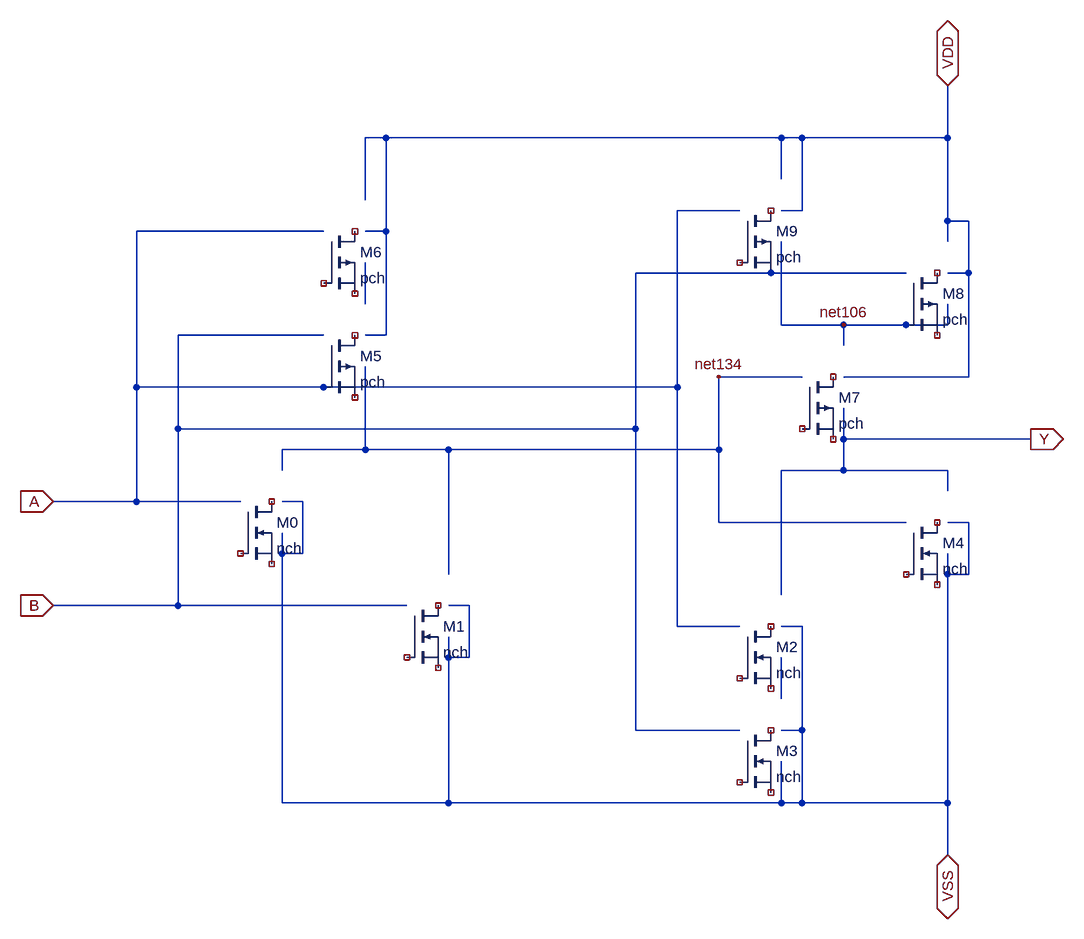
[diagram p0: schematic exor.asc]
exor.asc, the LTspice schematic file:
Version 4
SHEET 1 1680 1376
WIRE 1472 848 1504 848
WIRE 1472 848 1472 816
WIRE 1504 848 1504 768
WIRE 1472 768 1504 768
WIRE 1248 1088 1248 928
WIRE 1216 928 1248 928
WIRE 1248 1200 1472 1200
WIRE 1248 1200 1248 1088
WIRE 1216 1088 1248 1088
WIRE 704 1200 1216 1200
WIRE 704 1200 704 976
WIRE 704 976 736 976
WIRE 704 896 736 896
WIRE 736 976 736 896
WIRE 448 1200 448 816
WIRE 448 816 480 816
WIRE 448 816 448 784
WIRE 480 816 480 736
WIRE 448 736 480 736
WIRE 1472 1280 1472 1200
WIRE 1472 1200 1472 848
WIRE 1216 1200 1248 1200
WIRE 1216 1200 1216 1136
WIRE 704 976 704 944
WIRE 448 1200 704 1200
WIRE 1312 640 1600 640
WIRE 1312 640 1312 592
WIRE 1312 688 1312 640
WIRE 1312 688 1472 688
WIRE 1472 720 1472 688
WIRE 1216 688 1312 688
WIRE 1216 880 1216 688
WIRE 576 432 576 368
WIRE 1216 1040 1216 976
WIRE 1120 544 1248 544
WIRE 1120 656 1120 544
WIRE 1120 768 1408 768
WIRE 1120 768 1120 656
WIRE 704 656 1120 656
WIRE 576 656 576 528
WIRE 576 656 704 656
WIRE 704 848 704 656
WIRE 448 656 576 656
WIRE 448 688 448 656
WIRE 1056 928 1056 560
WIRE 224 560 1056 560
WIRE 1056 560 1056 288
WIRE 224 560 224 320
WIRE 224 320 512 320
WIRE 224 736 224 560
WIRE 224 736 384 736
WIRE 96 736 224 736
WIRE 1056 928 1152 928
WIRE 1056 288 1152 288
WIRE 1248 288 1248 176
WIRE 1248 176 1472 176
WIRE 1216 288 1248 288
WIRE 1472 384 1504 384
WIRE 1504 384 1504 304
WIRE 1472 304 1504 304
WIRE 1472 304 1472 176
WIRE 1504 544 1504 384
WIRE 1312 544 1504 544
WIRE 576 480 608 480
WIRE 608 480 608 320
WIRE 608 320 608 176
WIRE 608 176 1216 176
WIRE 576 320 608 320
WIRE 1472 96 1472 176
WIRE 1216 240 1216 176
WIRE 576 176 608 176
WIRE 1472 336 1472 304
WIRE 1216 176 1248 176
WIRE 576 272 576 176
WIRE 1312 496 1312 464
WIRE 1312 464 1472 464
WIRE 1472 464 1472 432
WIRE 1216 464 1312 464
WIRE 1216 464 1216 336
WIRE 992 624 992 384
WIRE 288 896 288 624
WIRE 288 624 288 480
WIRE 288 896 640 896
WIRE 288 480 512 480
WIRE 96 896 288 896
WIRE 992 384 1408 384
WIRE 992 1088 992 624
WIRE 992 1088 1152 1088
WIRE 288 624 992 624
FLAG 1120 544 net134
FLAG 1312 464 net106
SYMBOL PMOS 1152 288 R0
SYMATTR InstName M9
SYMATTR Value pch
SYMATTR Value2 w=6u l=1u
SYMBOL PMOS 1408 384 R0
SYMATTR InstName M8
SYMATTR Value pch
SYMATTR Value2 w=6u l=1u
SYMBOL PMOS 1248 544 R0
SYMATTR InstName M7
SYMATTR Value pch
SYMATTR Value2 w=6u l=1u
SYMBOL PMOS 512 320 R0
SYMATTR InstName M6
SYMATTR Value pch
SYMATTR Value2 w=6u l=1u
SYMBOL PMOS 512 480 R0
SYMATTR InstName M5
SYMATTR Value pch
SYMATTR Value2 w=6u l=1u
SYMBOL NMOS 1408 768 R0
SYMATTR InstName M4
SYMATTR Value nch
SYMATTR Value2 w=2u l=1u
SYMBOL NMOS 1152 1088 R0
SYMATTR InstName M3
SYMATTR Value nch
SYMATTR Value2 w=2u l=1u
SYMBOL NMOS 1152 928 R0
SYMATTR InstName M2
SYMATTR Value nch
SYMATTR Value2 w=2u l=1u
SYMBOL NMOS 640 896 R0
SYMATTR InstName M1
SYMATTR Value nch
SYMATTR Value2 w=2u l=1u
SYMBOL NMOS 384 736 R0
SYMATTR InstName M0
SYMATTR Value nch
SYMATTR Value2 w=2u l=1u
FLAG 1600 640 Y
IOPIN 1600 640 Out
FLAG 1472 1280 VSS
IOPIN 1472 1280 BiDir
FLAG 1472 96 VDD
IOPIN 1472 96 BiDir
FLAG 96 896 B
IOPIN 96 896 In
FLAG 96 736 A
IOPIN 96 736 In

The netlist it stands for:
* exor.asc
* M9: pch w=6u l=1u (symbol PMOS not certain, pin order unknown); nets seen at it: B
* M8: pch w=6u l=1u (symbol PMOS not certain, pin order unknown); nets seen at it: net106
* M7: pch w=6u l=1u (symbol PMOS not certain, pin order unknown); nets seen at it: 
* M6: pch w=6u l=1u (symbol PMOS not certain, pin order unknown); nets seen at it: 
* M5: pch w=6u l=1u (symbol PMOS not certain, pin order unknown); nets seen at it: A
* M4: nch w=2u l=1u (symbol NMOS not certain, pin order unknown); nets seen at it: 
* M3: nch w=2u l=1u (symbol NMOS not certain, pin order unknown); nets seen at it: 
* M2: nch w=2u l=1u (symbol NMOS not certain, pin order unknown); nets seen at it: 
* M1: nch w=2u l=1u (symbol NMOS not certain, pin order unknown); nets seen at it: 
* M0: nch w=2u l=1u (symbol NMOS not certain, pin order unknown); nets seen at it: 
.backanno
.end